# EAGLE design bbf-audio_out (EAGLE 9.6.2)
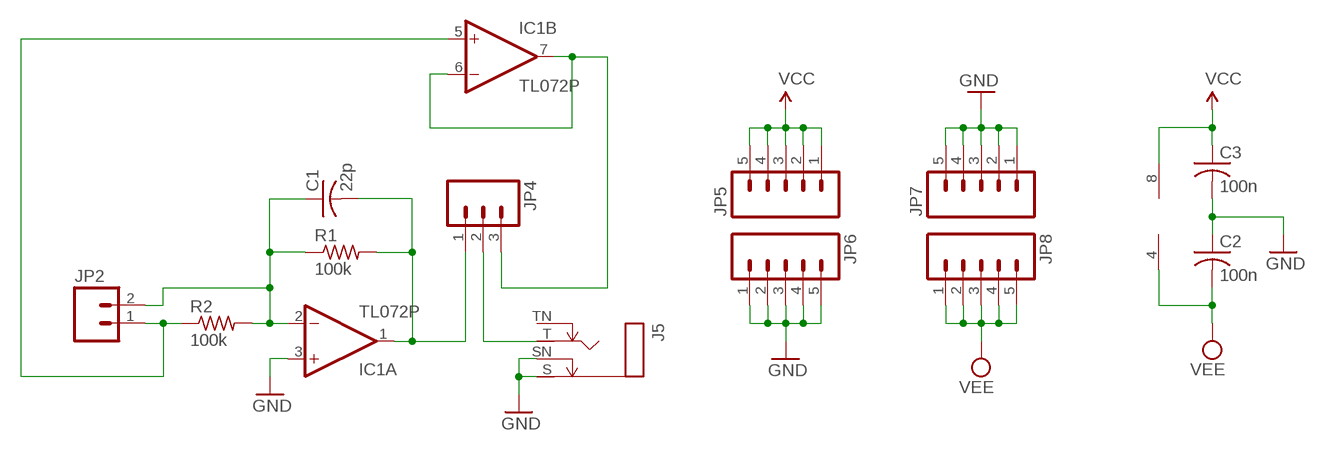
[diagram p0: schematic, sheet 1]

## Parts
C1  22p  C-US025-025X050  [C025-025X050]
C2  100n  C-US025-025X050  [C025-025X050]
C3  100n  C-US025-025X050  [C025-025X050]
IC1  TL072P  [DIL08]
J5  MONOSWSLIM  [NRJ4HF]
JP2  M02PTH  [1X02]
JP4  M03PTH  [1X03]
JP5  M05PTH  [1X05]
JP6  M05PTH  [1X05]
JP7  M05PTH  [1X05]
JP8  M05PTH  [1X05]
R1  100k  R-US_0204/7  [0204/7]
R2  100k  R-US_0204/7  [0204/7]

## Nets
GND: C2.1 C3.2 IC1.3(A:+IN) J5.S J5.SN JP6.1 JP6.2 JP6.3 JP6.4 JP6.5 JP7.1 JP7.2 JP7.3 JP7.4 JP7.5
N$1: C1.1 IC1.2(A:-IN) JP2.2 R1.1 R2.2
N$2: C1.2 IC1.1(A:OUT) JP4.1 R1.2
N$3: J5.T JP4.2
N$4: IC1.5(B:+IN) JP2.1 R2.1
N$5: IC1.6(B:-IN) IC1.7(B:OUT) JP4.3
VCC: C3.1 IC1.8(P:V+) JP5.1 JP5.2 JP5.3 JP5.4 JP5.5
VEE: C2.2 IC1.4(P:V-) JP8.1 JP8.2 JP8.3 JP8.4 JP8.5
Unconnected: J5.TN

## Library data of the parts
C1-C3 = rcl:C-US: CAPACITOR, American symbol
IC1 = linear:TL072: OP AMP
J5 = og-neutrik:MONOSW
JP2 = SparkFun:M02: Header 2 Standard 2-pin 0.1" header. Use with straight break away headers (SKU : PRT-00116), right angle break away headers (PRT-00553), swiss pins (PRT-00743), machine pins (PRT-00117), and female headers (PRT-00115). Molex polarized connector foot print use with SKU : PRT-08233 with associated crimp pins and housings.
JP4 = SparkFun:M03: Header 3 Standard 3-pin 0.1" header. Use with straight break away headers (SKU : PRT-00116), right angle break away headers (PRT-00553), swiss pins (PRT-00743), machine pins (PRT-00117), and female headers (PRT-00115). Molex polarized connector foot print use with SKU : PRT-08232 with associated crimp pins and housings.
JP5-JP8 = SparkFun:M05: Header 5 Standard 5-pin 0.1" header. Use with straight break away headers (SKU : PRT-00116), right angle break away headers (PRT-00553), swiss pins (PRT-00743), machine pins (PRT-00117), and female headers (PRT-00115). Molex polarized connector foot print use with SKU : PRT-08230 with associated crimp pins and housings.
R1 R2 = rcl:R-US_: RESISTOR, American symbol

## Board
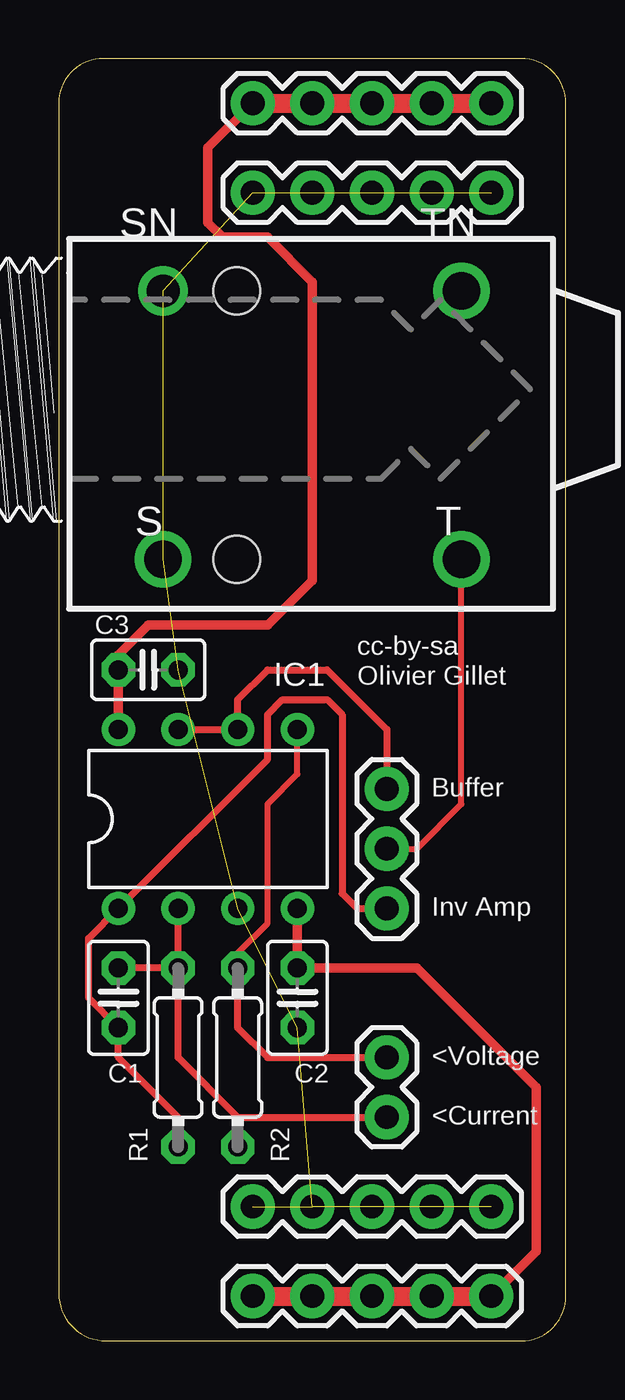
[diagram p1: board, top side]
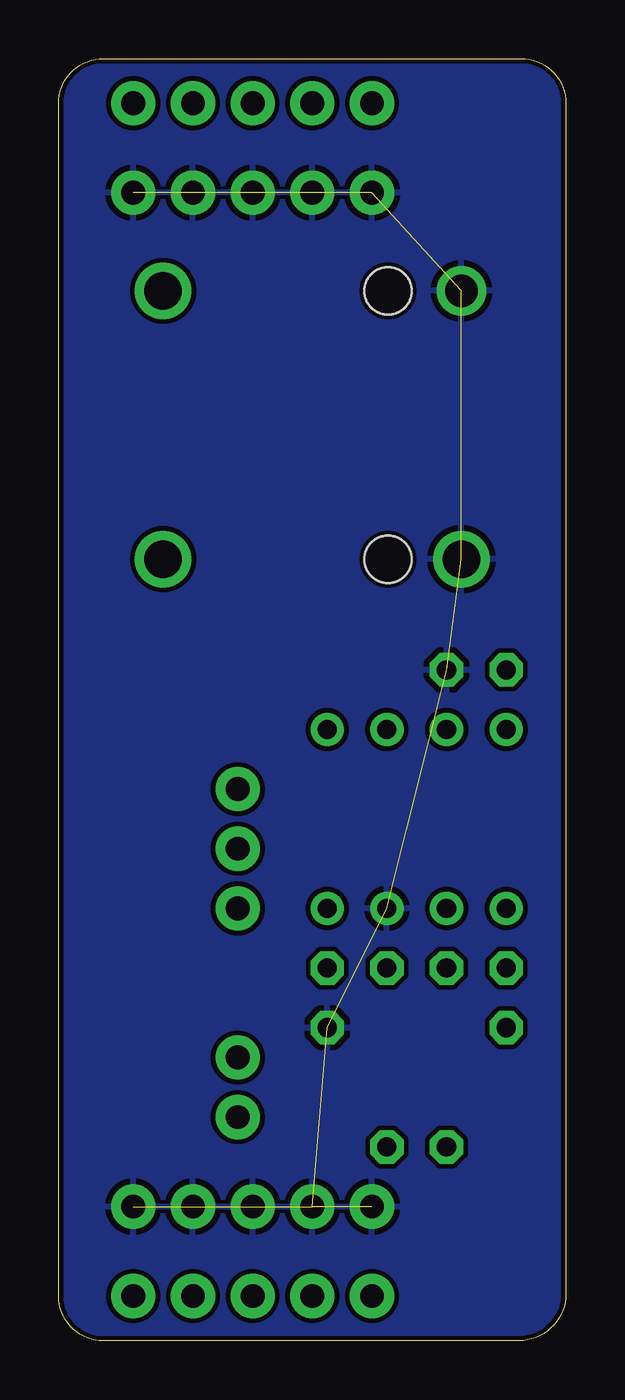
[diagram p2: board, bottom side, seen from below]

Size 21.59 x 54.6 mm. Coordinates in mm from the lower left corner, seen from the top.
Outline: 19.69,0 arc90 21.59,1.9 21.59,52.71 arc90 19.7,54.6 1.89,54.6 arc90 0,52.71 0,2.01 arc90 2.01,0 19.69,0
Copper layers (1*16): Top 0.035mm / dielectric 1.5mm / Bottom 0.035mm
Design rules "SparkFun_10mil *": minimum track width 8mil, minimum drill 20mil, track to track 8mil, track to pad 8mil, pad to pad 8mil, via to via 8mil, smd to smd 8mil, copper to edge 8mil, drill to drill 8mil, minimum pad ring 12mil, minimum via ring 10mil, stop-mask expansion 4mil, vias tented up to drill 25mil, thermal gap 10mil

### Footprints (pad centres in the part's own frame; a part is rotated, then mirrored left to right if it is on the bottom)
C025-025X050 = drill 0.813 octagon: 1 -1.27,0; 2 1.27,0
DIL08 = drill 0.813 pad 1.27: 1 -3.81,-3.81; 2 -1.27,-3.81; 3 1.27,-3.81; 4 3.81,-3.81; 5 3.81,3.81; 6 1.27,3.81; 7 -1.27,3.81; 8 -3.81,3.81
NRJ4HF = drill 1.6: S 5.08,7.992; T -7.62,7.992; TN -7.62,-3.438 | drill 1.4: SN 5.08,-3.438 | hole 2: 1.948,7.992; 1.948,-3.438
1X02 = drill 1.016 pad 1.88: 1 0,0; 2 2.54,0
1X03 = drill 1.016 pad 1.88: 1 0,0; 2 2.54,0; 3 5.08,0
1X05 = drill 1.016 pad 1.88: 1 0,0; 2 2.54,0; 3 5.08,0; 4 7.62,0; 5 10.16,0
0204/7 = drill 0.813 octagon: 1 -3.81,0; 2 3.81,0

### Placement (x,y rotation side)
C1  2.54,14.61 270 top
C2  10.16,14.61 90 top
C3  3.81,28.57 0 top
IC1  6.35,22.23 0 top
J5  9.53,41.27 180 top
JP2  13.97,12.06 270 top
JP4  13.97,18.41 90 top
JP5  8.26,52.71 0 top
JP6  8.26,48.89 0 top
JP7  8.26,5.71 0 top
JP8  8.26,1.9 0 top
R1  5.08,12.06 270 top
R2  7.62,12.06 270 top

### Tracks (layer width: path | path; a pad name or v marks a point on that pad's centre or on a via)
GND  (14 unrouted)
  pour Bottom: 19.69,0 arc90 21.59,1.9 21.59,52.71 arc90 19.69,54.61 1.9,54.61 arc90 0,52.71 0,1.9 arc90 1.9,0
N$1
  Top 0.305: R1.1 C1.1 | R1.1 IC1.2 | R1.1 5.08,12.06 7.62,9.52 | R2.2 7.62,9.52 | 7.62,9.52 JP2.2
N$2
  Top 0.305: R1.2 5.08,9.52 2.54,12.06 C1.2 1.27,14.61 1.27,17.14 IC1.1 8.89,24.77 8.89,26.67 9.53,27.3 11.43,27.3 12.06,26.67 12.06,19.05 12.7,18.41 JP4.1
N$3
  Top 0.254: JP4.2 15.24,20.95 17.15,22.86 J5.T
N$4
  Top 0.254: R2.1 7.62,16.51 8.89,17.78 8.89,22.86 10.16,24.13 IC1.5
  Top 0.305: R2.1 7.62,13.34 8.89,12.06 JP2.1
N$5
  Top 0.305: IC1.7 IC1.6 7.62,27.3 8.89,28.57 11.43,28.57 13.97,26.03 JP4.3
VCC
  Top 0.406: IC1.8 C3.1 2.54,29.21 3.81,30.48 8.89,30.48 10.79,32.38 10.79,45.09 8.89,46.99 6.99,46.99 6.35,47.62 6.35,50.8 JP5.1
  Top 0.813: JP5.1 JP5.2 JP5.3 JP5.4 JP5.5
VEE
  Top 0.406: IC1.4 C2.2 15.24,15.88 20.32,10.79 20.32,3.81 JP8.5
  Top 0.813: JP8.1 JP8.2 JP8.3 JP8.4 JP8.5

### Text on the board
tPlace: Buffer | Inv Amp | <Voltage | <Current
tNames: cc-by-sa | Olivier Gillet